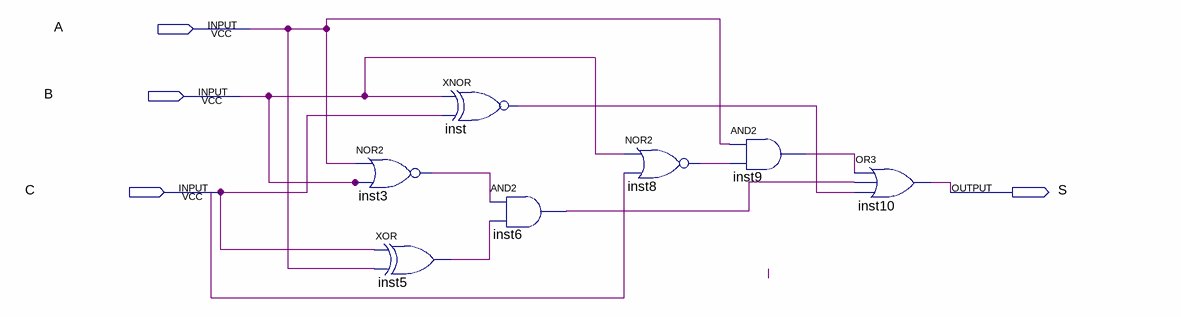
[diagram p0: schematic sheet]
// Quartus schematic TRABALHO01.bdf as structural Verilog: 7 symbols, 4 pins
module TRABALHO01 (
  input  A,
  input  B,
  input  C,
  output S
);

  wire inst3_out, inst5_out, inst6_out, inst8_out, inst9_out, inst_out;

  nor inst3 (inst3_out, A, B);
  xor inst5 (inst5_out, C, A);
  xnor inst (inst_out, B, C);
  and inst6 (inst6_out, inst3_out, inst5_out);
  nor inst8 (inst8_out, B, C);
  and inst9 (inst9_out, A, inst8_out);
  or inst10 (S, inst9_out, inst6_out, inst_out);
endmodule
